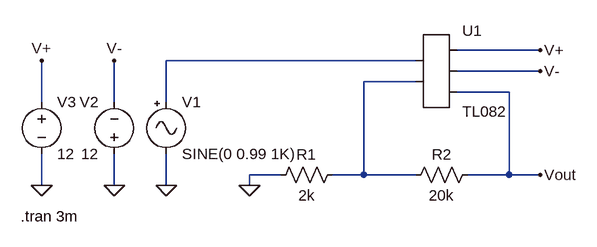
[diagram p0: schematic Draft1.asc]
Draft1.asc, the LTspice schematic file:
Version 4
SHEET 1 880 680
WIRE 352 112 224 112
WIRE 160 128 -224 128
WIRE 352 144 224 144
WIRE 160 160 80 160
WIRE 304 176 224 176
WIRE -416 192 -416 128
WIRE -304 192 -304 128
WIRE -224 192 -224 128
WIRE -48 304 -96 304
WIRE 80 304 80 160
WIRE 80 304 32 304
WIRE 160 304 80 304
WIRE 304 304 304 176
WIRE 304 304 240 304
WIRE 352 304 304 304
WIRE -416 320 -416 272
WIRE -304 320 -304 272
WIRE -224 320 -224 272
WIRE -96 320 -96 304
FLAG -96 320 0
FLAG -224 320 0
FLAG -304 320 0
FLAG -416 320 0
FLAG 352 304 Vout
FLAG 352 144 V-
FLAG 352 112 V+
FLAG -304 128 V-
FLAG -416 128 V+
SYMBOL res 256 288 R90
WINDOW 0 0 56 VBottom 2
WINDOW 3 32 56 VTop 2
SYMATTR InstName R2
SYMATTR Value 20k
SYMBOL res 48 288 R90
WINDOW 0 0 56 VBottom 2
WINDOW 3 32 56 VTop 2
SYMATTR InstName R1
SYMATTR Value 2k
SYMBOL Misc\\signal -224 176 R0
WINDOW 123 0 0 Left 0
WINDOW 39 0 0 Left 0
SYMATTR InstName V1
SYMATTR Value SINE(0 0.99 1K)
SYMBOL voltage -304 288 R180
WINDOW 0 24 96 Left 2
WINDOW 3 24 16 Left 2
WINDOW 123 0 0 Left 0
WINDOW 39 0 0 Left 0
SYMATTR InstName V2
SYMATTR Value 12
SYMBOL voltage -416 176 R0
WINDOW 123 0 0 Left 0
WINDOW 39 0 0 Left 0
SYMATTR InstName V3
SYMATTR Value 12
SYMBOL AutoGenerated\\TL082 192 144 R0
SYMATTR InstName U1
TEXT -448 368 Left 2 !.tran 3m

The netlist it stands for:
* Draft1.asc
R2 Vout N002 20k
R1 N002 0 2k
V1 N001 0 SINE(0 0.99 1K)
V2 0 V- 12
V3 V+ 0 12
* U1: TL082 (symbol AutoGenerated\TL082 not available, pins judged from their places): pin1=N001 pin2=N002 pin3=V+ pin4=V- pin5=Vout
.tran 3m
.backanno
.end